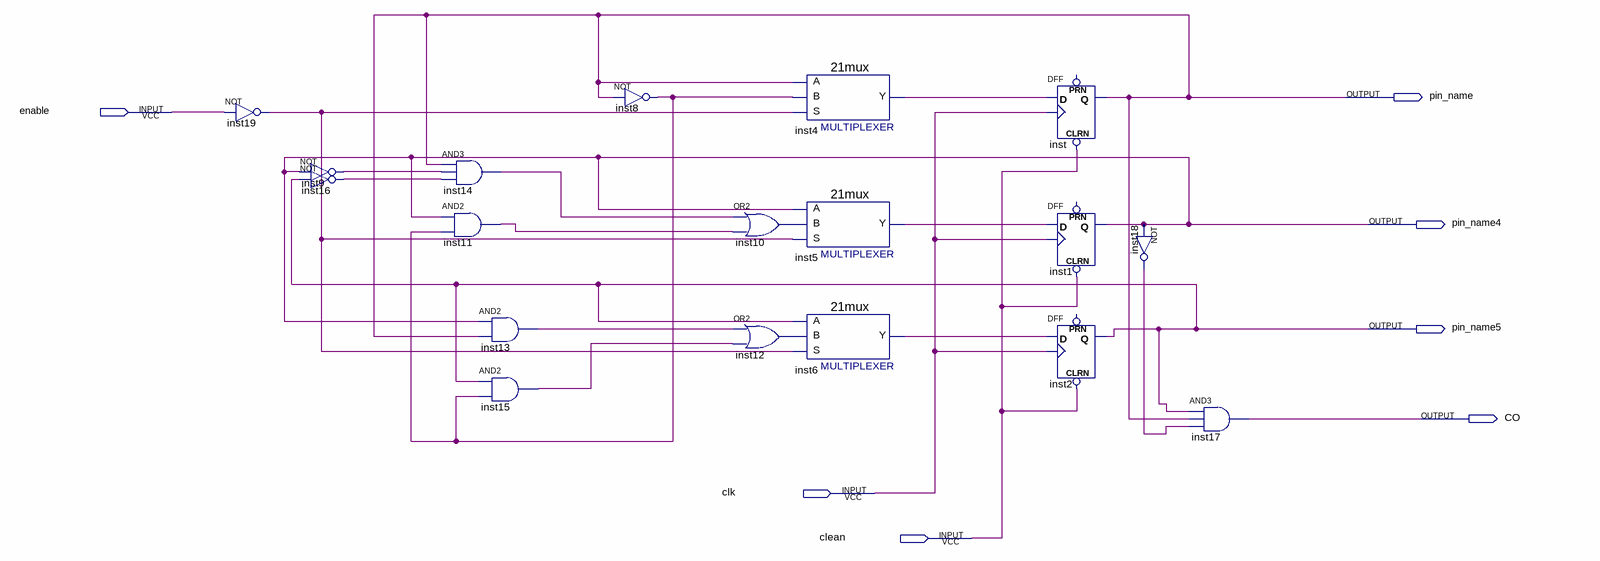
[diagram p0: schematic sheet]
// Quartus schematic Mod6.bdf as structural Verilog: 18 symbols, 7 pins
module Mod6 (
  input  enable,
  input  clk,
  input  clean,
  output pin_name,
  output pin_name4,
  output pin_name5,
  output CO
);

  wire inst4_y, inst5_y, inst6_y, inst8_out, inst9_out, inst10_out, inst11_out, inst12_out, inst13_out,
       inst14_out, inst15_out, inst16_out, inst18_out, inst19_out;

  not inst19 (inst19_out, enable);
  not inst9 (inst9_out, pin_name4);
  not inst16 (inst16_out, pin_name5);
  and inst14 (inst14_out, pin_name, inst9_out, inst16_out);
  and inst11 (inst11_out, pin_name4, inst8_out);
  and inst13 (inst13_out, pin_name4, pin_name);
  and inst15 (inst15_out, pin_name5, inst8_out);
  not inst8 (inst8_out, pin_name);
  or inst10 (inst10_out, inst14_out, inst11_out);
  or inst12 (inst12_out, inst13_out, inst15_out);
  \21mux  inst4 (.S(inst19_out), .B(inst8_out), .A(pin_name), .Y(inst4_y));
  \21mux  inst5 (.S(inst19_out), .B(inst10_out), .A(pin_name4), .Y(inst5_y));
  \21mux  inst6 (.S(inst19_out), .B(inst12_out), .A(pin_name5), .Y(inst6_y));
  DFF inst (.CLRN(clean), .CLK(clk), .D(inst4_y), .Q(pin_name));  // open: PRN
  DFF inst1 (.CLRN(clean), .CLK(clk), .D(inst5_y), .Q(pin_name4));  // open: PRN
  DFF inst2 (.CLRN(clean), .CLK(clk), .D(inst6_y), .Q(pin_name5));  // open: PRN
  not inst18 (inst18_out, pin_name4);
  and inst17 (CO, pin_name5, pin_name, inst18_out);
endmodule
